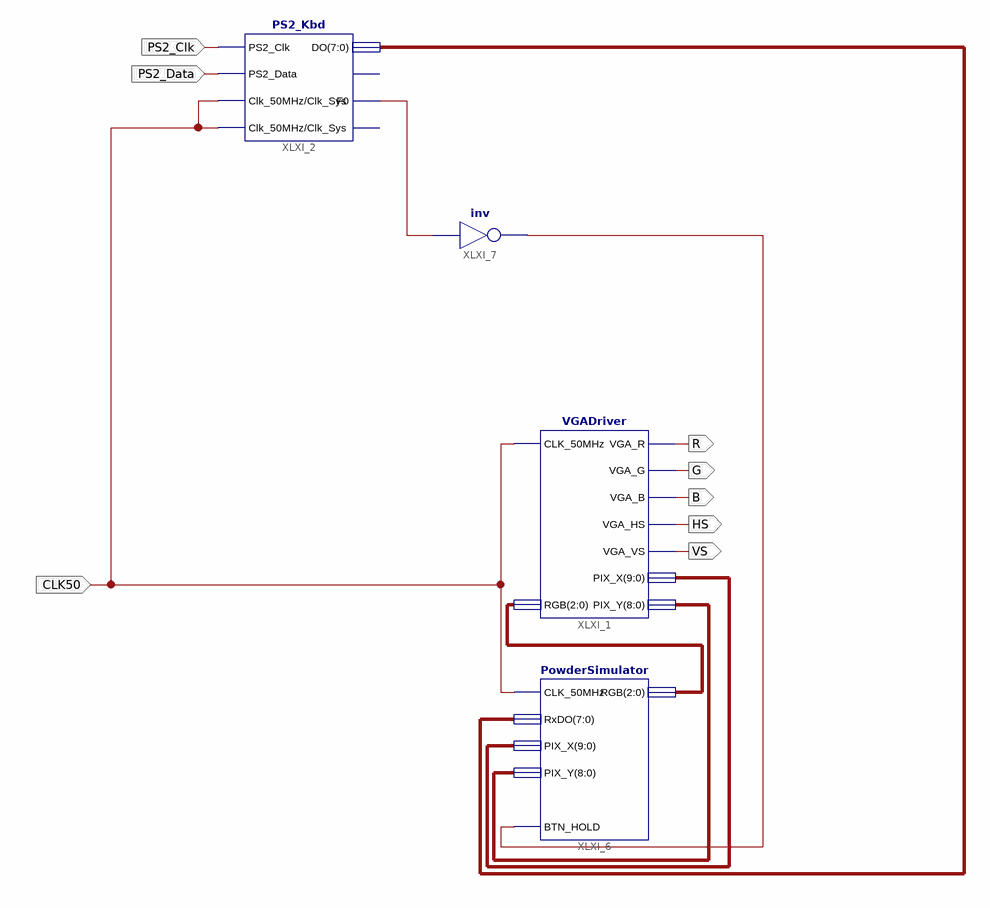
[diagram p0: schematic sheet 1]
// Xilinx ISE schematic PowderToy.sch (spartan3e) as structural Verilog: 4 symbols, 8 ports
module PowderToy (
  input  CLK50,
  input  PS2_Clk,
  input  PS2_Data,
  output R,
  output G,
  output B,
  output HS,
  output VS
);

  wire XLXN_42, XLXN_44;
  wire [2:0] XLXN_29;
  wire [7:0] XLXN_37;
  wire [8:0] XLXN_39;
  wire [9:0] XLXN_35;

  VGADriver XLXI_1 (
    .CLK_50MHz(CLK50), .RGB(XLXN_29), .VGA_R(R), .VGA_G(G), .VGA_B(B), .VGA_HS(HS), .VGA_VS(VS),
    .PIX_X(XLXN_35), .PIX_Y(XLXN_39));
  PS2_Kbd XLXI_2 (
    .PS2_Clk(PS2_Clk), .PS2_Data(PS2_Data), .Clk_50MHz(CLK50), .F0(XLXN_42), .DO(XLXN_37), .Clk_Sys(CLK50));  // open: E0, DO_Rdy
  PowderSimulator XLXI_6 (
    .CLK_50MHz(CLK50), .RxDO(XLXN_37), .PIX_X(XLXN_35), .PIX_Y(XLXN_39), .RGB(XLXN_29), .BTN_HOLD(XLXN_44));
  not XLXI_7 (XLXN_44, XLXN_42);
endmodule
